# EasyEDA Pro project Transistörle Led Kontrol Devresi.eprj

# Schematic Schematic1
Board Name: Board1; Create Date: 2025-12-10; Page Name: P1; Project Name: Transistörle Led Kontrol Devresi; Schematic Name: Schematic1; Update Date: 2025-12-10; Company: EasyEDA.com; Page Size: A4; Version: V1.0
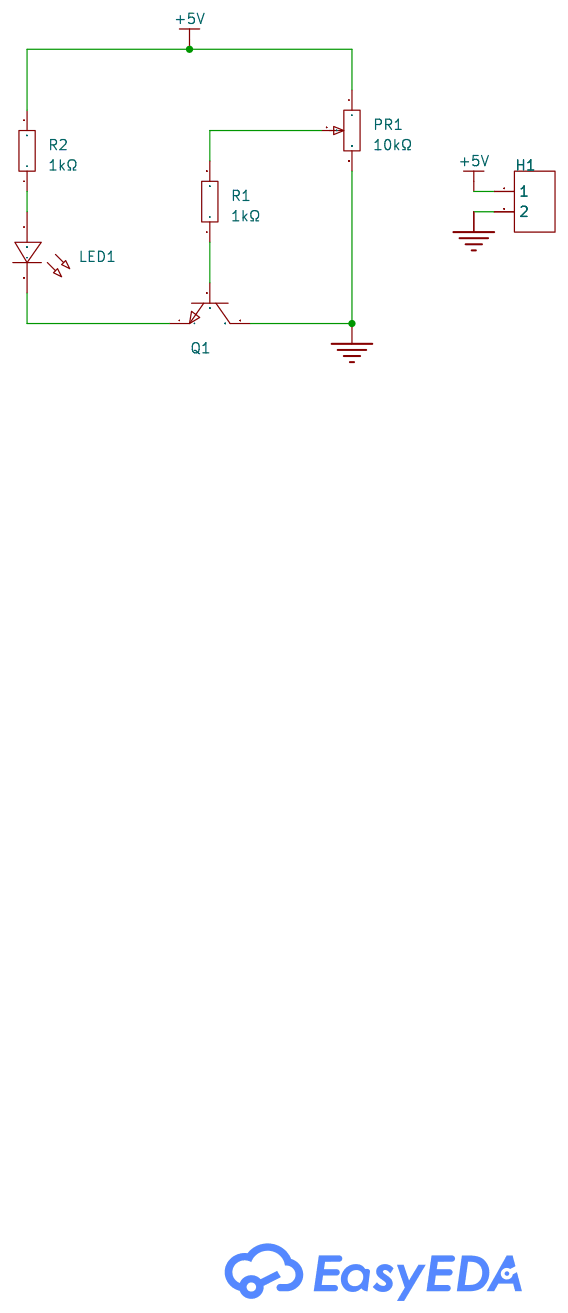
[diagram p0: schematic sheet]

## Parts
H1  -  [HDR-TH_2P-P2.54-V-F]
LED1  -  [LED_TH-3mm]
PR1  10kΩ  [R_3296]
Q1  -  [S8050_TO_92]
R1  1kΩ  [Res_1/4W]
R2  1kΩ  [Res_1/4W]

## Library data of the parts
H1 = 2.54-1*2P母: Pitch:2.54mm Number of Holes:2 Number of Rows:1 Holes Structure:1x2P Row Spacing:- Mounting Type:Straight Insulation Height:- Contact Material:- Contact Plating:-; LCSC Part Name: 2.54mm 1x2P; Supplier Part: C49661; Manufacturer: BOOMELE(博穆精密); Supplier Footprint: 直插,P=2.54mm; JLCPCB Part Class: Extended Part; Datasheet: https://atta.szlcsc.com/upload/public/pdf/source/20151109/1457707570988.pdf; Supplier: LCSC; Pitch: 2.54mm; Number of Holes: 2; Number of Rows: 1; Holes Structure: 1x2P; Mounting Type: Straight; LCSC On Sale: 1; JLCPCB On Sale: 1; Type: 直插; Number of Pins: 2; Connector Type: 排母
LED1 = LED_TH-R_3mm: Supplier Footprint: 插件
PR1 = R_3296: Supplier Footprint: 直插
Q1 = S8050_TO_NPN: Supplier Footprint: TO-92
R1 R2 = Res_AXIAL-1/4W: Supplier Footprint: 轴向引线

## Nets
+5V: H1.1 PR1.1 R2.2
GND: H1.2 PR1.3 Q1.3(C)
$1N388: LED1.1(C) R2.1
$1N392: LED1.2(A) Q1.1(E)
$1N425: Q1.2(B) R1.1
$1N429: PR1.2 R1.2

# Board PCB1
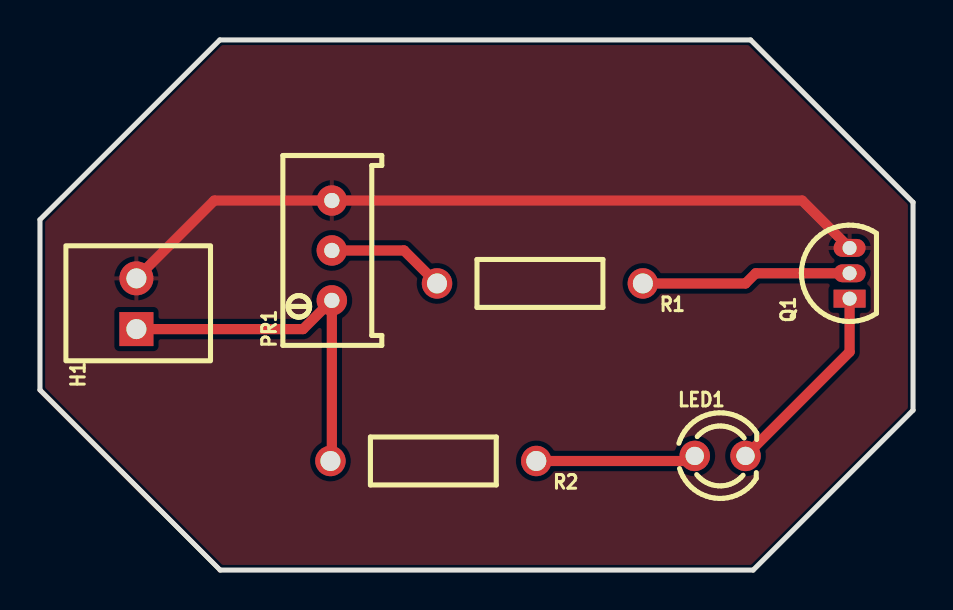
[diagram p1: board, top side]
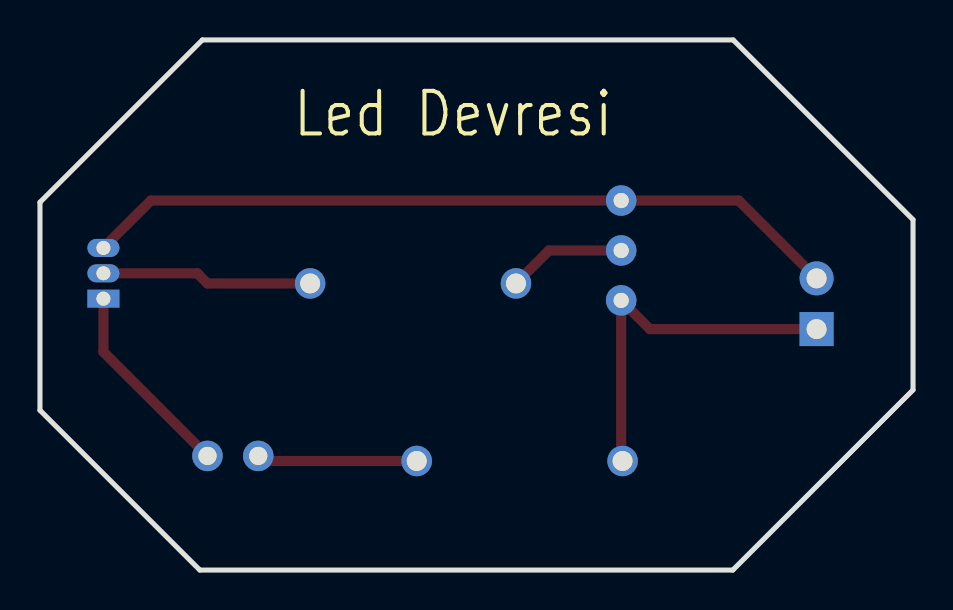
[diagram p2: board, bottom side, seen from below]

Outline 43.69 x 26.54 mm; copper layers: Top Layer, Bottom Layer. Coordinates in mm from the lower left corner of the outline.
Outline path: 0,17.54 9,26.54 35.56,26.54 43.69,18.42 43.69,8 35.69,0 9.02,0 0,9.02 0,17.54
Stack: Top Layer 0.035mm / Dielectric1 1.51mm FR4 er 4.5 / Bottom Layer 0.035mm

## Design rules (mm)
template: JLCPCB Capability(Two Layers Board)
spacing copperThickness1oz (default): track to track 0.102, other pairs 0.152 to 0.3
spacing copperThickness2oz: track to track 0.203, other pairs 0.152 to 0.3
track width copperThickness1oz (default): min 0.127, default 0.254, max 2.54
track width copperThickness2oz: min 0.203, default 0.254, max 2.54
differential pair differentialPair (default): width min 0.127, default 0.254, max 2.54; gap min 0.152, default 0.152
via viaSize (default): diameter min 0.5, default 0.61, max 10; hole min 0.3, default 0.305, max 6.3

## Placement (name value [footprint] x y rotation side)
H1  -  [HDR-TH_2P-P2.54-V-F]  4.83 13.34 90 top
LED1  -  [LED_TH-3mm]  34.04 5.72 0 top
PR1  10kΩ  [R_3296]  14.48 16 90 top
Q1  -  [S8050_TO_92]  40.51 14.86 90 top
R1  1kΩ  [Res_1/4W]  25.02 14.35 180 top
R2  1kΩ  [Res_1/4W]  19.69 5.46 180 top

## Footprints (pads in the part's own frame, mm; a bottom-side part is the same pattern mirrored in y, then rotated)
HDR-TH_2P-P2.54-V-F
  rect 1.7x1.7 hole 1: 1(-1.27,0)
  round 1.7 hole 1: 2(1.27,0)
LED_TH-3mm
  round 1.524 hole 0.914: 1(-1.27,0) 2(1.27,0)
R_3296
  round 1.524 hole 0.762: 1(-2.499,-0.127) 2(0,-0.127) 3(2.499,-0.127)
Res_1/4W
  round 1.524 hole 1: 1(-5.15,0) 2(5.15,0)
S8050_TO_92
  rect 0.899x1.6 hole 0.701: 1(-1.27,0)
  oval 0.899x1.6 hole 0.701: 2(0,0) 3(1.27,0)

## Nets
As in the schematic.

## Routing (per net, layer and track width the routed paths; a pad name or vN(x,y) marks a point on that pad's centre or on a via; arc(x,y) is an arc through that point)
+5V: length 18.4
  Top Layer w0.508: H1.1 13.17,12.06 14.6,13.5 14.6,5.53 R2.2
GND: length 38.3
  Top Layer w0.508: Q1.3 38.14,18.5 8.72,18.5 H1.2
$1N388: length 8
  Top Layer w0.508: R2.1 32.51,5.46 LED1.1
$1N392: length 10
  Top Layer w0.508: Q1.1 40.51,10.92 LED1.2
$1N425: length 10.6
  Top Layer w0.508: Q1.2 35.81,14.86 35.31,14.35 R1.1
$1N429: length 5.9
  Top Layer w0.508: 14.6,16 18.22,16 R1.2

## Copper pours and planes (outline as drawn; the poured copper is in the pictures)
GND on Top Layer: 9,26.54 0.36,17.91 0,17.91 0,9.02 9.02,0 35.69,0 43.69,8 43.69,18.29 43.81,18.42 35.83,26.4 35.71,26.4 35.56,26.54

## Text on the board
Bottom Silkscreen Layer: Led Devresi
